# Altium project ethercat32.PrjPcb (part 3 of 3)

## Sheet DRV8300_VOLTAGE_REG.SchDoc
size B
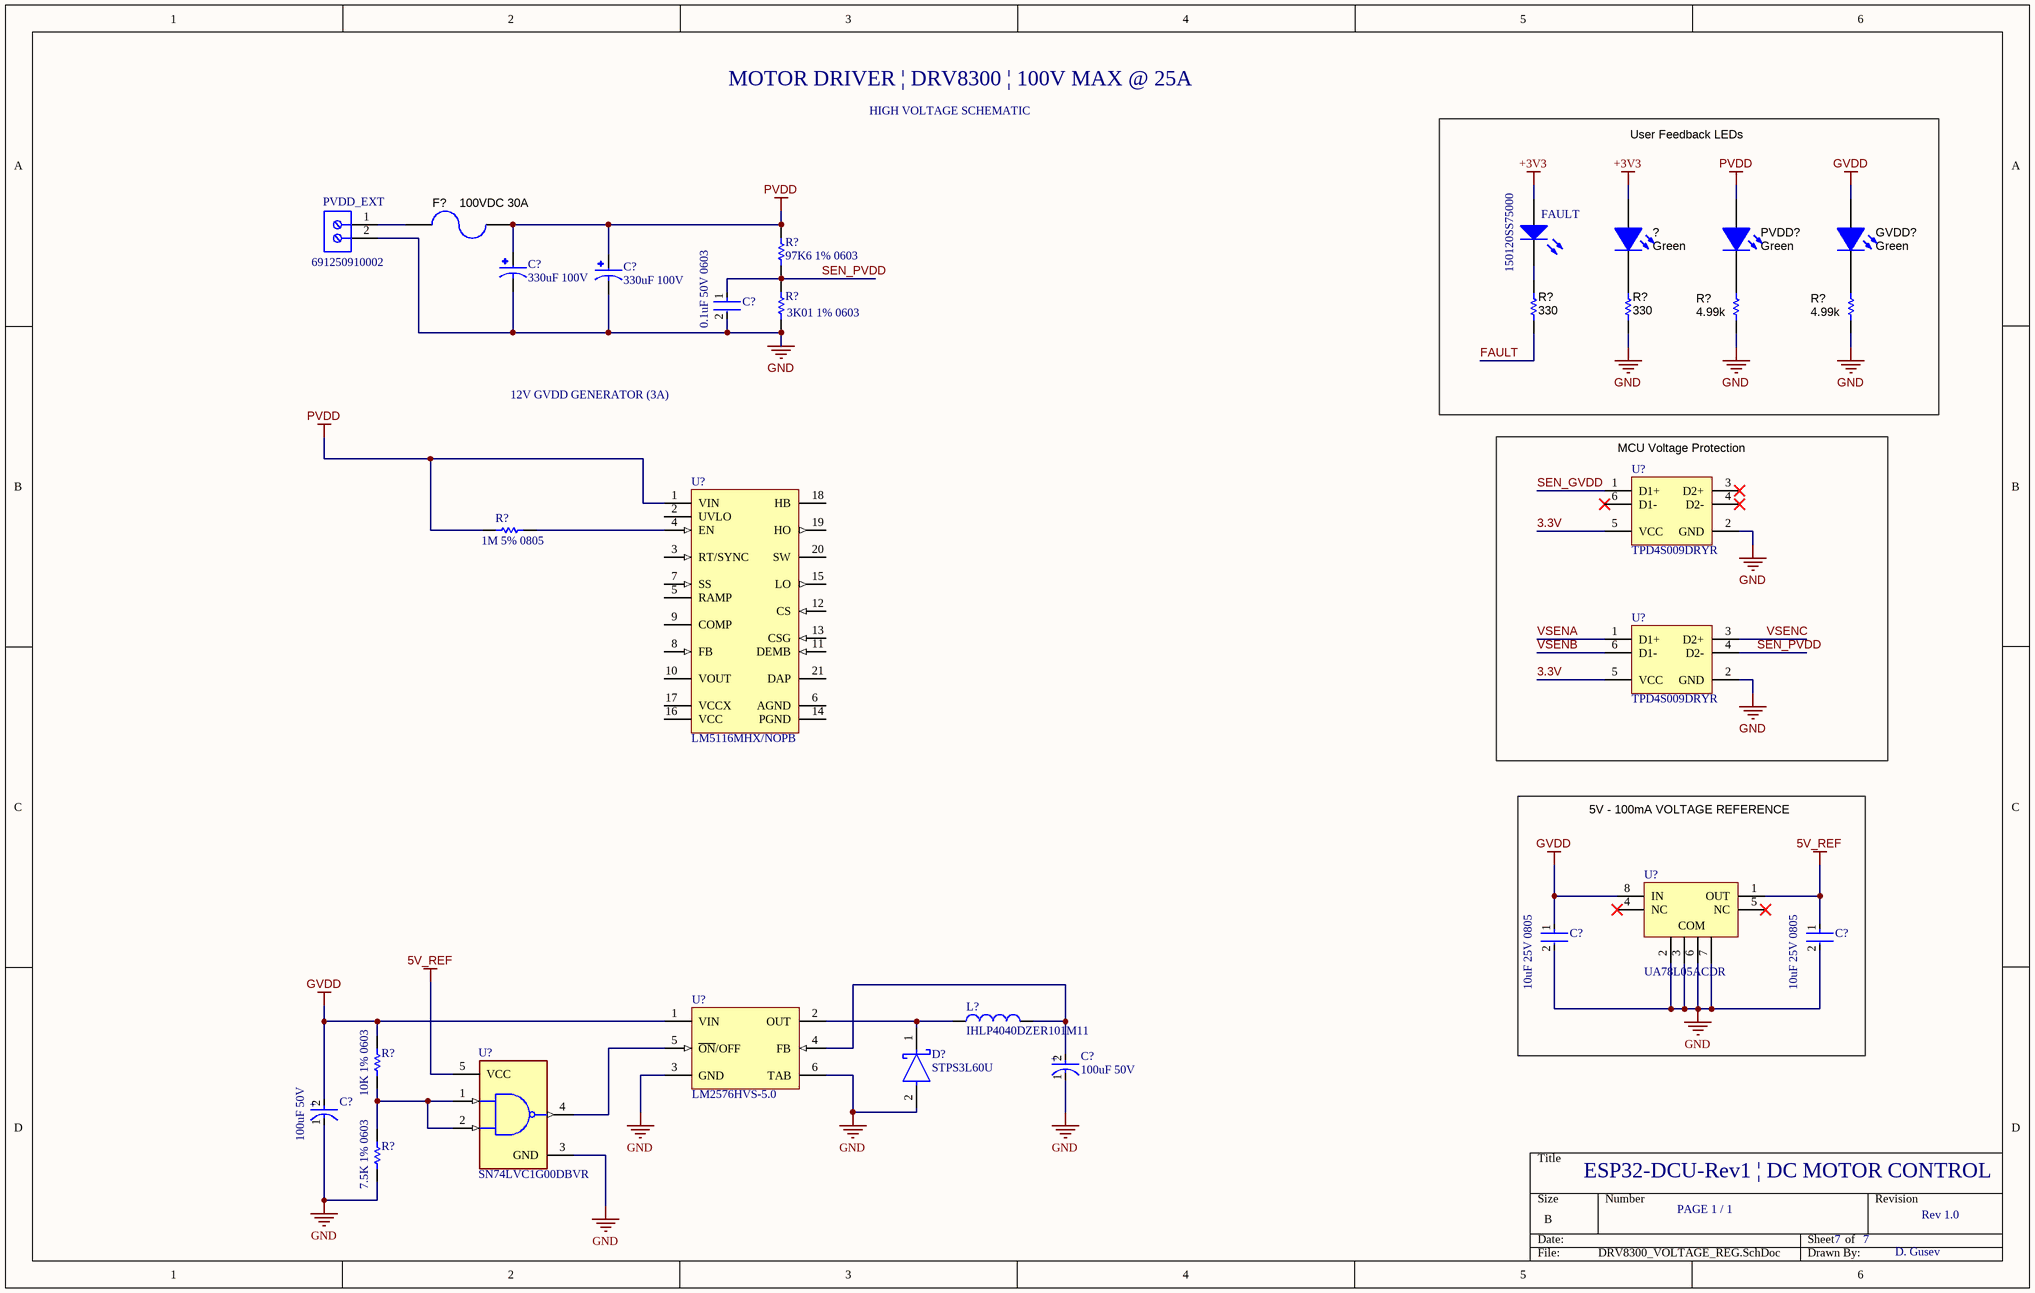
[diagram p8: DRV8300_VOLTAGE_REG.SchDoc]

### Parts
(Parts that share a designator on the sheet are numbered #1, #2 ... from top to bottom, then left to right.)
?  value Green  [LED_LTST-C171]
C?#46  330uF 100V  [CAP_330UF_100V_EEVFK2A331M]
C?#47  330uF 100V  [CAP_330UF_100V_EEVFK2A331M]
C?#48  0.1uF 50V 0603  [FP-C0603C-CF-MFG]
C?#49  10uF 25V 0805  [FP-GRM21B-0_15-IPC_C]
C?#50  10uF 25V 0805  [FP-GRM21B-0_15-IPC_C]
C?#51  100uF 50V  [FP-EEE-FK1H101P-MFG]
C?#52  100uF 50V  [FP-EEE-FK1H101P-MFG]
D?#16  STPS3L60U  [FP-SMB-MFG]
F?  100VDC 30A  [Fuse_0463]
FAULT  150120SS75000  [1206_A]
GVDD?  value Green  [LED_LTST-C171]
L?  IHLP4040DZER101M11  [VISH-IHLP4040DZER101M11_V]
PVDD?  value Green  [LED_LTST-C171]
PVDD_EXT  691250910002  [691250910002]
R?#75  97K6 1% 0603  [RESC1608X55X30NL15T15]
R?#76  ValueDisplayed: 330  [0603L]  (hidden comment: CRCW0603330RJNEA)
R?#77  ValueDisplayed: 330  [0603L]  (hidden comment: CRCW0603330RJNEA)
R?#78  value 4.99k  [0603L]  (hidden comment: CRCW06034K99FKEA)
R?#79  value 4.99k  [0603L]  (hidden comment: CRCW06034K99FKEA)
R?#80  3K01 1% 0603  [RESC1608X55X30LL15T15]
R?#81  1M 5% 0805  [RESC0805(2012)_L]
R?#82  10K 1% 0603  [RESC1608X55X25ML10T15]
R?#83  7.5K 1% 0603  [RESC1608X55X25ML10T15]
U?#8  TPD4S009DRYR  [DRY0006A]
U?#9  LM5116MHX/NOPB  [PWP0020A_M]
U?#10  TPD4S009DRYR  [DRY0006A]
U?#11  UA78L05ACDR  [D0008A_L]
U?#12  LM2576HVS-5.0  [KTT0005B_L]
U?#13  SN74LVC1G00DBVR  [FP-DBV0005A-MFG]

### Blocks framed on the sheet
User Feedback LEDs: ? FAULT GVDD? PVDD? R?#76-R?#79
MCU Voltage Protection: U?#8 U?#10
5V - 100mA VOLTAGE REFERENCE: C?#49 C?#50 U?#11

### Nets
5V_REF: C?#50.1 U?#11.1(OUT) U?#13.5(VCC)
+3V3: ?.1(A) FAULT.2(A)
GND: C?#46.2 C?#47.2 C?#48.2 C?#49.2 C?#50.2 C?#51.1(C) C?#52.1(C) D?#16.2(A) PVDD_EXT.2 R?#77.1 R?#78.1 R?#79.1 R?#80.1 R?#83.1 U?#8.2(GND) U?#10.2(GND) U?#11.2(COM) U?#11.3(COM) U?#11.6(COM) U?#11.7(COM) U?#12.3(GND) U?#12.6(TAB) U?#13.3(GND)
GVDD: C?#49.1 C?#52.2(A) GVDD?.1(A) R?#82.2 U?#11.8(IN) U?#12.1(VIN)
PVDD: C?#46.1 C?#47.1 F?.1 PVDD?.1(A) R?#75.2 R?#81.1 U?#9.1(VIN)
3.3V: U?#8.5(VCC) U?#10.5(VCC)
FAULT: R?#76.1
SEN_GVDD: U?#8.1(D1+)
SEN_PVDD: C?#48.1 R?#75.1 R?#80.2 U?#10.4(D2-)
VSENA: U?#10.1(D1+)
VSENB: U?#10.6(D1-)
VSENC: U?#10.3(D2+)
Net?_2: ?.2(K) R?#77.2
NetC?#51_2: C?#51.2(A) L?.2 U?#12.4(FB)
NetD?#16_1: D?#16.1(K) L?.1 U?#12.2(OUT)
NetF?_2: F?.2 PVDD_EXT.1
NetFAULT_1: FAULT.1(K) R?#76.2
NetGVDD?_2: GVDD?.2(K) R?#79.2
NetPVDD?_2: PVDD?.2(K) R?#78.2
NetR?#81_2: R?#81.2 U?#9.4(EN)
NetR?#82_1: R?#82.1 R?#83.2 U?#13.1(A) U?#13.2(B)
NetU?#12_5: U?#12.5(~{ON}/OFF) U?#13.4(Y)

Not connected (* = marked no-connect by the designer): U?#8 3(D2+)* 4(D2-)* 6(D1-)*; U?#9 2(UVLO) 3(RT/SYNC) 5(RAMP) 6(AGND) 7(SS) 8(FB) 9(COMP) 10(VOUT) 11(DEMB) 12(CS) 13(CSG) 14(PGND) 15(LO) 16(VCC) 17(VCCX) 18(HB) 19(HO) 20(SW) 21(DAP); U?#11 4(NC)* 5(NC)*

### Notes on the sheet
- MOTOR DRIVER | DRV8300 | 100V MAX @ 25A
- HIGH VOLTAGE SCHEMATIC
- 12V GVDD GENERATOR (3A)
- ESP32-DCU-Rev1 | DC MOTOR CONTROL
- PAGE 1 / 1
- 7
- Rev 1.0
- D. Gusev
- (in symbol CMP-2000-06208-2) +

### Library data of the parts
? GVDD? PVDD? = CMP-0002830-3: LED, Green, SMD; Manufacturer: Lite-On; PartNumber: LTST-C171GKT; Vf_V: 2.1V; Io_A: 20A; Value1: W; SizeArea_mm2: 2.5; SizeAreaWB_mm2: 6.75; SizeX_mm: 2; SizeY_mm: 1.25; SizeZ_mm: 1.2; CompType: LED; MountType: SMT; RoHS: Y; PackageReference: 0805 LED; Type: AlInGaP; Value2: 2.1V; Color: green; ComponentLink1URL: https://sps06.itg.ti.com/sites/KMS/crossdivteams/altium/docs/ComponentDatasheets/LTST-C171GKT.pdf; ComponentLink1Description: Datasheet link
C?#46 C?#47 = EEVFK2A331M: Cap Aluminum Lytic 330uF 100V 20% (18 X 16.5mm) SMD 0.153 Ohm 917mA 2000h 105C T/R; MP: EEV-FK2A331M; MF: Panasonic; Value: *; Package: RADIAL-2 Panasonic; Check_prices: https://www.snapeda.com/parts/EEV-FK2A331M/Panasonic%20Electronic%20Components/view-part/40548/?ref=eda; Price: None; SnapEDA_Link: https://www.snapeda.com/parts/EEV-FK2A331M/Panasonic%20Electronic%20Components/view-part/40548/?ref=snap; Availability: In Stock
C?#48 = CMP-2006-03061-2: CAP CER 0.1UF 50V X7R 0603; Manufacturer: KEMET; Manufacturer Part Number: C0603C104K5RACTU; Tolerance: 0.1; Description: C0603 0.10 μF X7R 30ppm/°C 10.00% 50 V; Temperature Coefficient: 30ppm/°C; Material: Ceramic; Automotive Grade: Grade 1; Value: 0.10 μF; Temperature: -55°C to +125°C; RoHS: TRUE; Temperature Range High: +125°C; Lead Free: Yes; Octopart: https://octopart.com/c0603c104k5ractu-kemet-139244; Digikey Description: CAP CER 0.1UF 50V X7R 0603; Category: Cap; Package: C0603C-CF; ComponentLink2Description: Datasheet; Temperature Range Low: -55°C; Device Class L1: Passive Components; Voltage Rating: 50 V; Automotive: Yes; Device Class L3: Ceramic Capacitors; ComponentLink2URL: https://api.kemet.com/component-edge/download/datasheet/C0603C100J5GACAUTO.pdf; Capacitance: 0.10 μF; Device Class L2: Capacitors; Temperature Characteristic: X7R; Height: 0.87mm
C?#49 C?#50 = CMP-2007-03541-2: Chip Multilayer Ceramic Capacitors for General Purpose, 0805, 10uF, X5R, 15%, 10%, 25V; Length: 2mm; Depth: 1.25mm; Termination: SMD/SMT; Voltage: 25V; Height: 1.25mm; Material: Ceramic; Thickness: 0.053inch; Radiation Hardening: No; Min Operating Temperature: -55°C; Width: 0.049inch; Package Quantity: 1; Mount: Surface Mount; Dielectric: X5R; Packaging: Tape and Reel; Capacitance: 10uF; Voltage Rating (DC): 25V; Lead Free: Lead Free; Max Operating Temperature: 85°C; Case Code (Imperial): 0805; Case/Package: 0805; Tolerance: 10%; Voltage Rating: 25V; Case Code (Metric): 2012
C?#51 C?#52 = CMP-2000-06208-2: CAP ALUM 100UF 20% 50V SMD; Manufacturer Part Number: EEE-FK1H101P; Manufacturer: Panasonic Electronic Components; Automotive Grade: Grade 2; Dissipation Factor: 10%; Life: 2000Hours; Ripple Current: 350mA; Material: Aluminum; Esr: 0.34Ω; Leakage Current: 50uA; Tolerance: 20%; Package: 0; ComponentLink2URL: https://industrial.panasonic.com/cdbs/www-data/pdf/RDE0000/ABA0000C1181.pdf; Temperature Range Low: -55°C; Voltage Rating: 50V; ComponentLink2Description: Datasheet; Category: Cap; Digikey Description: CAP ALUM 100UF 20% 50V SMD; Octopart: https://octopart.com/eeefk1h101p-panasonic-4642841; Automotive: Yes; Temperature: -55°C to +105°C; Capacitance: 100uF; Lead Free: Yes; Mouser Description: Cap Aluminum Lytic 100uF 50V 20% (8 X 10.2mm) SMD 350mA 2000h 105C Automotive T/R; Height: 10.5mm; Device Class L3: Aluminum Electrolytic Capacitors; Value: 100uF; Device Class L1: Passive Components; RoHS: TRUE; Device Class L2: Capacitors; Temperature Range High: +105°C
D?#16 = CMP-12187-000023-1: DIODE SCHOTTKY 60V 3A SMB; Manufacturer: STMicroelectronics; Standoff Height: 0.05mm; Peak Reverse Current: 150uA; Max Junction Temp: +150°C; Max Surge Forward Current: 100A; Octopart: https://octopart.com/stps3l60u-stmicroelectronics-334329; Category: Diode; Height: 2.65mm; RoHS: TRUE; Mouser Description: Schottky diode Configuration: Single Housing type: DO-214AA=SMB Peak conducting-state current: 100 A; Forward Current: 3A; Manufacturer Part Number: STPS3L60U; Temperature: to +150°C; ComponentLink2URL: https://www.st.com/resource/en/datasheet/stps3l60.pdf; Max Repetitive Reverse Voltage: 60V; Device Class L1: Discrete Semiconductors; Automotive: No; Device Class L3: Schottky Diodes; Digikey Description: DIODE SCHOTTKY 60V 3A SMB; Lead Free: Yes; Temperature Range High: +150°C; Package: SMB; ComponentLink2Description: Datasheet; Device Class L2: Diodes
F? = CMP-0077200-3: Fuse, 30 A, 250 VAC, 100 VDC, SMD; PartNumber: 0463030.ER; Manufacturer: Littelfuse; VAC_V: 250V; SizeAreaWB_mm2: 61.952; Rtyp_Ohm: 1.93m; SizeArea_mm2: 31.512; MeltingTyp: 916; SizeZ_mm: 3.12; VDC_V: 100V; SizeX_mm: 10.1; Interrupt_AC: 100A; Interrupt_DC: 50A; Fuse Speed: Fast; Fuse Technology: Board Mount; TaMax_C: 125°C; TaMin_C: -55°C; ComponentLink1Description: Datasheet URL; RoHS: Y; Supplier Part Number 3: 576-0463030.ER; Supplier 1: Digi-Key; Irating_A: 30A; PackageReference: 10.1x3.12mm; Supplier Part Number 2: 64W8551; Supplier 2: Newark; SizeY_mm: 3.12; ComponentLink1URL: http://www.littelfuse.com/~/media/electronics/datasheets/fuses/littelfuse_fuse_463_datasheet.pdf.pdf; CompType: Fuse; MountType: SMT; Supplier Part Number 1: F6439CT-ND; Supplier 3: Mouser
FAULT = CMP-1426-00017-1: SMD mono-color Chip LED, WL-SMCW, Super Red; Manufacturer: Wuerth Elektronik; ComponentLink1URL: http://www.we-online.com; PackageReference: 1206_A; ComponentLink2Description: Datasheet; ComponentLink1Description: Manufacturer URL; ComponentLink2URL: http://katalog.we-online.com/led/datasheet/150120SS75000.pdf; Color: Super Red; PartNumber: 150120SS75000
L? = CMP-2000-06447-1: Low Profile, High Current IHLP(R) Inductor, 100 uH, +/- 20%, 2.5 A, -55 to 125 degC, 2-Pin SMD, RoHS, Tape and Reel; Manufacturer: Vishay; Qualification: AEC-Q200; Test Frequency: 100kHz; Maximum DC Resistance: 270mOhms; Type: LowProfileHighCurrentIHLPInductor; Inductance: 100uH; Unit Weight: 0.070548oz; Shielding: Shielded; Brand: Vishay/Dale; Maximum DC Current: 2.25A; Termination Style: SMD/SMT; Mounting Style: SMD/SMT; Tolerance: 20%; Factory Pack Quantity: 500; Product Category: FixedInductors; Mounting Technology: SurfaceMount; Manufacturer URL: http://www.vishay.com/; Operating Temperature Range: -55Cto+125C; Datasheet Version: 08/2015; Product: PowerInductors; Packaging: Reel; Length: 10.3mm; Package Description: 2-Pin Surface Mount Device, Body 10.3 x 10.3 mm; Height: 4mm; Width: 10.3mm; Series: IHLP-4040DZ-11; RoHS: True; Package Reference: IHLP4040DZER101M11; Tradename: IHLP; Datasheet URL: http://www.vishay.com/docs/34192/lp40dz11.pdf; Package / Case: 4040
PVDD_EXT = CMP-1502-02750-1: Serie 2509 - 9.52 mm Horizontal Entry Modular with Rising Cage Clamp WR-TBL, 2 pin; Manufacturer: Wurth Elektronik; Pin Number: 2; Pitch: 9.52mm; Datasheet URL: http://katalog.we-online.de/em/datasheet/6912509100XX.pdf; Mounting Technology: THT; Package Reference: 691250910002; Publisher: WurthElektronik; Packaging: Box; Manufacturer URL: http://www.we-online.de; Operating Temperature: -30to120degC; Part Number: 691250910002
R?#75 = CMP-2000-00697-1: Manufacturer: Panasonic; Part Number: ERJ-3EKF9762V
R?#76 R?#77 = CMP-0025785-4: RES, 330, 5%, 0.1 W, AEC-Q200 Grade 0, 0603; Manufacturer: Vishay-Dale; Power_W: 100mW; TempCo: 200 ppm/C; Value_Code: 330R; Value: 330; EIA_Code: E24; SizeX_mm: 1.6; SizeY_mm: 0.8; SizeZ_mm: 1; Value2: 0.1W; SizeArea_mm2: 1.28; CompType: Resistor; AEC Qualified: Y; VDC_V: 75V; AEC Category: Q200; AEC Grade: 0; Supplier Part Number 2: 59M6805; Supplier 2: Newark; Supplier Part Number 3: 71-CRCW0603J-330-E3; Supplier 3: Mouser; RoHS: E; Value1: 5%; MountType: SMT; Supplier 1: Digi-Key; PackageReference: 0603; Tolerance_%: 5%; Res_ohm: 330; PartNumber: CRCW0603330RJNEA; ComponentLink1Description: Datasheet link; Supplier Part Number 1: 541-330GCT-ND; Technology: Thick Film; ComponentLink1URL: http://www.vishay.com/docs/20035/dcrcwe3.pdf
R?#78 R?#79 = CMP-0022458-4: RES, 4.99 k, 1%, 0.1 W, AEC-Q200 Grade 0, 0603; Manufacturer: Vishay-Dale; Value_Code: 4k99; Power_W: 100mW; Value2: 0.1W; VDC_V: 75V; TempCo: 100 ppm/C; EIA_Code: E96; AEC Category: Q200; AEC Qualified: Y; AEC Grade: 0; SizeArea_mm2: 1.28; SizeX_mm: 1.6; SizeY_mm: 0.8; SizeZ_mm: 1; CompType: Resistor; PartNumber: CRCW06034K99FKEA; PackageReference: 0603; RoHS: E; Res_ohm: 4.99k; Tolerance_%: 1%; Value1: 1%; MountType: SMT; Technology: Thick Film; ComponentLink1Description: Datasheet link; ComponentLink1URL: http://www.vishay.com/docs/20035/dcrcwe3.pdf; Supplier 1: Digi-Key; Supplier Part Number 1: 541-4.99KHCT-ND; Supplier 2: Newark; Supplier Part Number 2: 52K8500; Supplier 3: Mouser; Supplier Part Number 3: 71-CRCW0603-4.99K-E3; ValueDisplayed: 4.99k
R?#80 = CMP-2000-00416-1: Part Number: ERJ-3EKF3011V; Manufacturer: Panasonic
R?#81 = CMP-1013-00146-1: 1M 0.125W 5% 0805 (2012 Metric)  SMD; Case-Metric: 2012; Value: 1000000.00 Ohm; Case-EIA: 0805; Technology: SMT; Tolerance: 5 %; Power: 0.125 W
R?#82 = CMP-2000-05022-1: Resistor, 10 KOhm, +/- 5%, 100 mW, -55 to 155 degC, 0603 (1608 Metric), RoHS, Tape and Reel; Manufacturer: Yageo; Resistance: 10kOhms; Voltage Rating: 50V; Temperature Coefficient: 100PPM/C; Power Rating: 100mW; Package Reference: 603; Series: RC; Case Code - mm: 1608; Packaging: Reel; Datasheet URL: http://www.farnell.com/datasheets/443971.pdf; Datasheet Version: Rev. 4, 04/2009; Operating Temperature Range: -55Cto+155C; Product: ThickFilmResistorsGeneralPurpose; Package Description: 2-Pin Surface Mount Device, Body 1.6 x 0.8 mm; Manufacturer URL: http://www.yageo.com/; Case Code - in: 0603; Tolerance: 5%; Termination Style: SMD/SMT
R?#83 = CMP-2000-04293-1: Manufacturer: Yageo; Part Number: RC0603JR-077K5L
U?#8 U?#10 = CMP-0326-00033-3: ESD Solution for High-Speed Differential Interface, 4 Channels, -40 to +85 degC, 6-pin SON (DRY), Green (RoHS & no Sb/Br); Manufacturer: Texas Instruments; Breakdown Voltage(Min)(V): 9; Differential Capacitance(pF): 0.05; IO Leakage Current(nA): Jan-00; IEC 61000-4-2 Contact(+/- kV): 8; IO Capacitance(Typ)(pF): 0.8; Mounting Technology: Surface Mount; ComponentLink3URL: SamplesURL:http://www.ti.com/product/tpd4s009#samples; ComponentLink2URL: http://www.ti.com/general/docs/lit/getliterature.tsp?genericPartNumber=TPD4S009&fileType=pdf; ComponentLink1Description: Manufacturer URL; PackageDescription: 6-Pin Plastic Small Outline No-Lead, 1 x 1.45 x 0.6 mm Body, 0.5 mm Pitch; IEC 61000-4-2 Air-Gap(+/- kV): 9; Eco-Plan: Green (RoHS & no Sb/Br); PartNumber: TPD4S009DRYR; PackageReference: DRY0006A; DatasheetVersion: SLVS817E; ComponentLink3Description: URL Link1; SubFamily: ESD Solution; ComponentLink1URL: http://www.ti.com/; PackageVersion: revF, Dec-2011; ComponentLink2Description: Datasheet
U?#9 = CMP-0069-01482-3: Wide Range Synchronous Buck Controller, 20-pin TSSOP-EP, Pb-Free; Manufacturer: Texas Instruments; PackageTopMarking: NSUZXYTT*LM5116*MH; PowerWise: Y; CompType: Switcher; ComponentLink1URL: http://www.ti.com/general/docs/lit/getliterature.tsp?genericPartNumber=LM5116&fileType=pdf; PackageReference: PWP0020A; RoHS: Y; PinCount: 20; Code_JEDEC: MO-153-ACT; PackageDescription: Molded TSSOP, Jedec, 6.5 x 4.4 x 0.9mm Body, 20 Lead, 0.65mm Pitch, Exposed Pad; ComponentLink1Description: Datasheet URL
U?#11 = CMP-0324-00139-3: Fixed Regulator with 7 to 20 V Input and 5 V Output, 0 to 125 degC, 8-Pin SOIC (D), Green (RoHS & no Sb/Br); Manufacturer: Texas Instruments; Iout(Max)(A): 0.1; Vout(Min)(V): 5; Iq(Typ)(mA): 6; Vin(Max)(V): 20; Vin(Min)(V): 7; ComponentLink2Description: Package Specification; PackageVersion: revM, Jun-2011; PartNumber: UA78L05ACDR; DatasheetVersion: SLVS010S; Eco-Plan: Green (RoHS & no Sb/Br); PackageDescription: 8-Pin Plastic Small Outline Integrated Circuit, 4.9 x 3.9 mm, Pitch 1.27 mm Pitch; ComponentLink1URL: http://www.ti.com/general/docs/lit/getliterature.tsp?genericPartNumber=UA78L05A&fileType=pdf; PackageReference: D0008A; ComponentLink1Description: Datasheet; ComponentLink3URL: Samples URL:http://www.ti.com/product/ua79m05#samples; Code_JEDEC: MS-012AA; ComponentLink2URL: http://www.ti.com/litv/pdf/msoi002j; Vout(Max)(V): 5; Mounting Technology: Surface Mount; ComponentLink3Description: URL Link1
U?#12 = CMP-0069-00141-3: SIMPLE SWITCHER® 3A Step-Down Voltage Regulator, 5-pin TO-263; Manufacturer: Texas Instruments; PackageTopMarking: NSUZXYTTE#*LM2576*HVS-5.0 P+; PowerWise: N; RoHS: N; PackageDescription: TO-263, Molded, .400 x .390 x .180in, 5 Lead, .067in Pitch, Surface Mount; Code_JEDEC: MO-169-AB; CompType: Switcher; ComponentLink1URL: http://www.ti.com/general/docs/lit/getliterature.tsp?genericPartNumber=LM2576HV&fileType=pdf; ComponentLink1Description: Datasheet URL; PinCount: 5; PackageReference: KTT0005B
U?#13 = CMP-0859-00113-4: IC GATE NAND 1CH 2-INP SOT23-5; Manufacturer: Texas Instruments; Logic Function Desc: Inverting; Number Of Circuits: 1; Nominal Supply Current: 10uA; Max Supply Voltage: 5.5V; Standoff Height: 0mm; Frequency: 100MHz; Propagation Delay: 4.3ns; Min Supply Voltage: 1.65V; Description: NAND Gate IC 1 Channel SOT-23-5; Number Of Inputs: 2; Digikey Description: IC GATE NAND 1CH 2-INP SOT23-5; Ipc Land Pattern Name: SOT95P280X145-5; Automotive: No; RoHS: TRUE; Mouser Description: IC Mos 74LVC1G00/SO/SN74LVC1G00DBVR TEXAS INSTRUMENT RoHS LVC SOt23; Package: DBV0005A; ComponentLink2URL: http://www.ti.com/lit/ds/symlink/sn74lvc1g00.pdf; Device Class L2: Logic ICs; Ambient Temperature Range Low: -40°C; Temperature Range Low: -40°C; Ambient Temperature Range High: +125°C; Device Class L1: Integrated Circuits (ICs); Height: 1.45mm; Octopart: https://octopart.com/sn74lvc1g00dbvr-texas+instruments-465560; Temperature: -40°C to +125°C; Temperature Range High: +125°C; Category: IC; ComponentLink2Description: Datasheet; Number Of Outputs: 1; Device Class L3: Logic Gates; Manufacturer Part Number: SN74LVC1G00DBVR; Lead Free: Yes

## Sheet Power_Regulation.SchDoc
size B
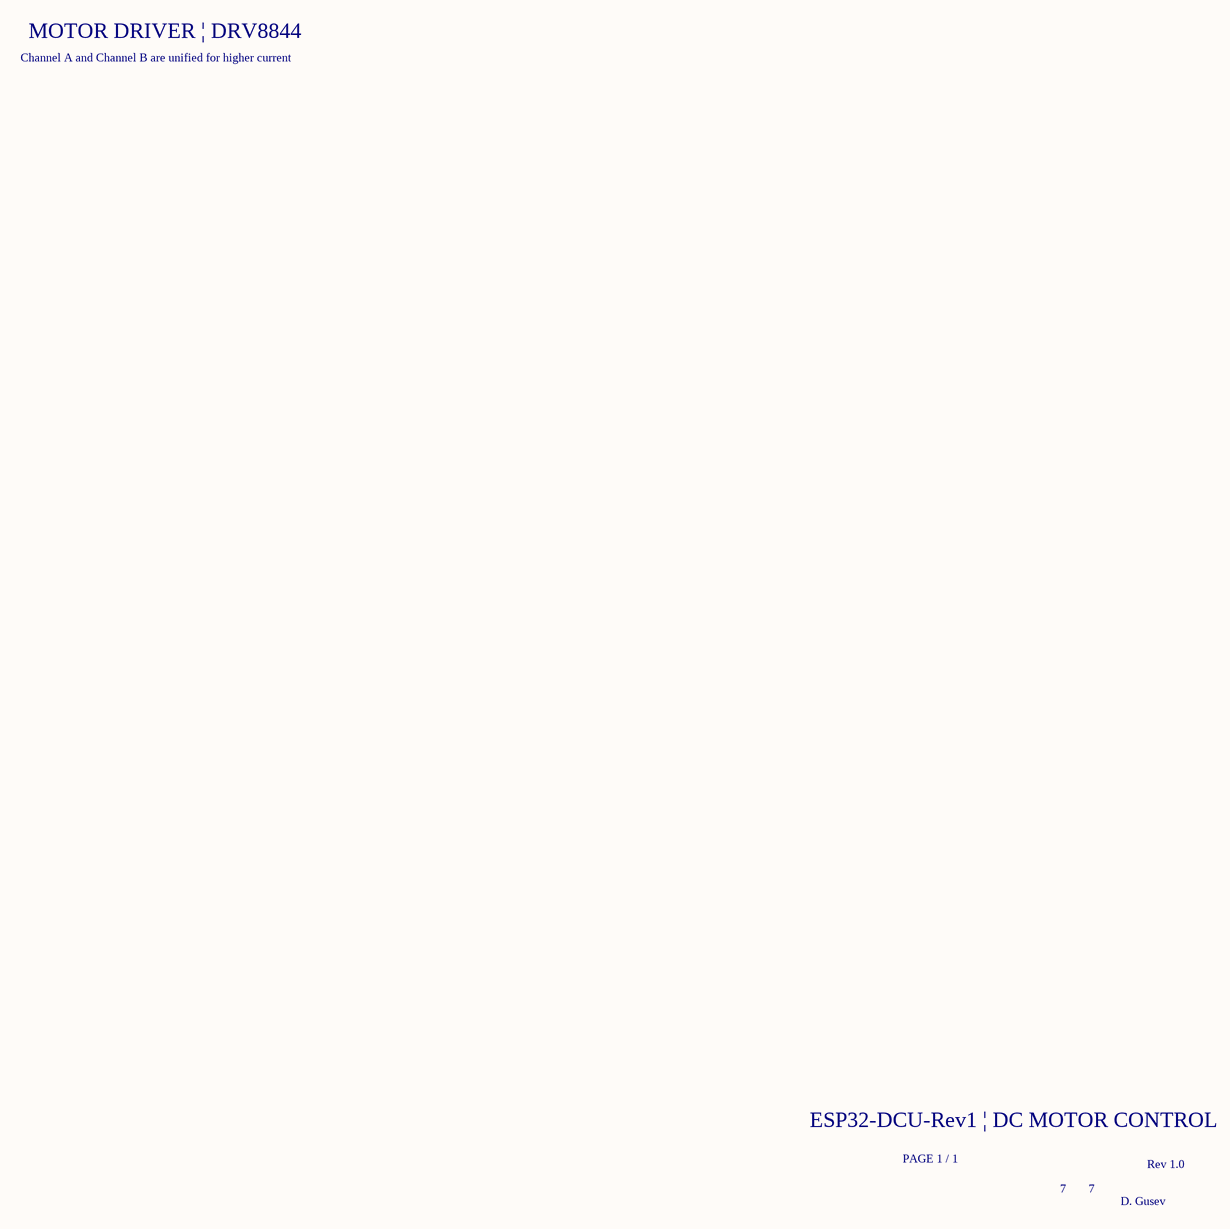
[diagram p9: Power_Regulation.SchDoc]

### Notes on the sheet
- MOTOR DRIVER | DRV8844
- Channel A and Channel B are unified for higher current
- ESP32-DCU-Rev1 | DC MOTOR CONTROL
- PAGE 1 / 1
- 7
- Rev 1.0
- D. Gusev

## Nets that join several sheets
+3V3: USB-ESP32 (10 pins), ESP32 (5 pins), EtherCAT (C41.2 EtherCAT_EEPROM.8 R35.2 R36.2), LAN9252-2 (DEBUG.5 DEBUG.6), DRV8300_CONTROLS (R?#7.1 R?#8.1 R?#9.1 R?#10.1), DRV8300_GATES (6 pins), DRV8300_FEEDBACK (C?#32.1 R?#73.2 U?#4.4), DRV8300_VOLTAGE_REG (?.1 FAULT.2)
+3V3_LAN9252: EtherCAT (5 pins), LAN9252-1 (17 pins)
+5V: USB-ESP32 (R8.1), LAN9252-2 (DEBUG.3 DEBUG.4)
GND: USB-ESP32 (25 pins), ESP32 (13 pins), EtherCAT (19 pins), LAN9252-1 (30 pins), LAN9252-2 (DEBUG.39 DEBUG.40), DRV8300_CONTROLS (7 pins), DRV8300_GATES (21 pins), DRV8300_FEEDBACK (21 pins), DRV8300_VOLTAGE_REG (23 pins)
GVDD: DRV8300_CONTROLS (6 pins), DRV8300_FEEDBACK (R?#64.2), DRV8300_VOLTAGE_REG (6 pins)
PVDD: DRV8300_GATES (9 pins), DRV8300_VOLTAGE_REG (7 pins)
VDD33TXRX1: EtherCAT (5 pins), LAN9252-1 (C8.2 C9.2 FB1.2 LAN9252.51)
VDD33TXRX2: EtherCAT (5 pins), LAN9252-1 (C10.2 C11.2 FB2.2 LAN9252.64)
ESP32_RX: USB-ESP32 (U1.21), ESP32 (ESP32-S2.38)
ESP32_TX: USB-ESP32 (U1.20), ESP32 (ESP32-S2.37)
GHA: DRV8300_CONTROLS (DRV8300.19), DRV8300_GATES (R?#11.1 R?#13.1)
GHB: DRV8300_CONTROLS (DRV8300.16), DRV8300_GATES (R?#12.1 R?#14.1)
GHC: DRV8300_CONTROLS (DRV8300.13), DRV8300_GATES (R?#32.1 R?#33.1)
GLA: DRV8300_CONTROLS (DRV8300.11), DRV8300_GATES (R?#21.1 R?#23.1)
GLB: DRV8300_CONTROLS (DRV8300.10), DRV8300_GATES (R?#22.1 R?#24.1)
GLC: DRV8300_CONTROLS (DRV8300.9), DRV8300_GATES (R?#38.1 R?#39.1)
GPIO0: USB-ESP32 (Q2.3), ESP32 (ESP32-S2.3 ESP32_BOOT.2 R12.2)
IRQ: LAN9252-1 (LAN9252.44), LAN9252-2 (DEBUG.26)
NetEtherCAT_EEPROM_5: EtherCAT (EtherCAT_EEPROM.5 R36.1), LAN9252-1 (LAN9252.42)
NetEtherCAT_EEPROM_6: EtherCAT (EtherCAT_EEPROM.6 R35.1), LAN9252-1 (LAN9252.43)
NetLAN9252_45: EtherCAT (R22.2 R30.2 R32.1), LAN9252-1 (LAN9252.45)
NetLAN9252_46: EtherCAT (R29.2 R34.2), LAN9252-1 (LAN9252.46)
NetLAN9252_48: EtherCAT (R21.2 R33.2), LAN9252-1 (LAN9252.48)
RESET: USB-ESP32 (Q1.3), ESP32 (ESP32-S2.41 ESP32_RESET.2 R11.2)
RXA_N: EtherCAT (C34.2 ECAT_INPUT.7 R19.1), LAN9252-1 (LAN9252.54)
RXA_P: EtherCAT (C33.2 ECAT_INPUT.5 R18.1), LAN9252-1 (LAN9252.55)
RXB_N: EtherCAT (C39.2 ECAT_OUTPUT.7 R27.1), LAN9252-1 (LAN9252.61)
RXB_P: EtherCAT (C38.2 ECAT_OUTPUT.5 R26.1), LAN9252-1 (LAN9252.60)
SHA: DRV8300_CONTROLS (C?#1.2 DRV8300.18), DRV8300_GATES (R?#19.1)
SHB: DRV8300_CONTROLS (C?#2.2 DRV8300.15), DRV8300_GATES (R?#20.1)
SHC: DRV8300_CONTROLS (C?#3.2 DRV8300.12), DRV8300_GATES (R?#37.1)
SNA: DRV8300_GATES (NetTie2.1), DRV8300_FEEDBACK (C?#29.1 R?#45.1)
SNB: DRV8300_GATES (NetTie4.1), DRV8300_FEEDBACK (C?#33.1 R?#54.1)
SNC: DRV8300_GATES (NetTie6.1), DRV8300_FEEDBACK (C?#39.1 R?#60.1)
SPA: DRV8300_GATES (NetTie1.1), DRV8300_FEEDBACK (C?#31.1 R?#47.1)
SPB: DRV8300_GATES (NetTie3.1), DRV8300_FEEDBACK (C?#38.2 R?#56.1)
SPC: DRV8300_GATES (NetTie5.1), DRV8300_FEEDBACK (C?#41.2 R?#62.1)
TXA_N: EtherCAT (C32.2 ECAT_INPUT.3 R17.1), LAN9252-1 (LAN9252.52)
TXA_P: EtherCAT (C31.2 ECAT_INPUT.1 R16.1), LAN9252-1 (LAN9252.53)
TXB_N: EtherCAT (C37.2 ECAT_OUTPUT.3 R25.1), LAN9252-1 (LAN9252.63)
TXB_P: EtherCAT (C36.2 ECAT_OUTPUT.1 R24.1), LAN9252-1 (LAN9252.62)
USBC_D+: USB-ESP32 (U3.3), ESP32 (U4.3)
USBC_D-: USB-ESP32 (U3.7), ESP32 (U4.7)